# EAGLE design ToFnLED (EAGLE 9.6.2)
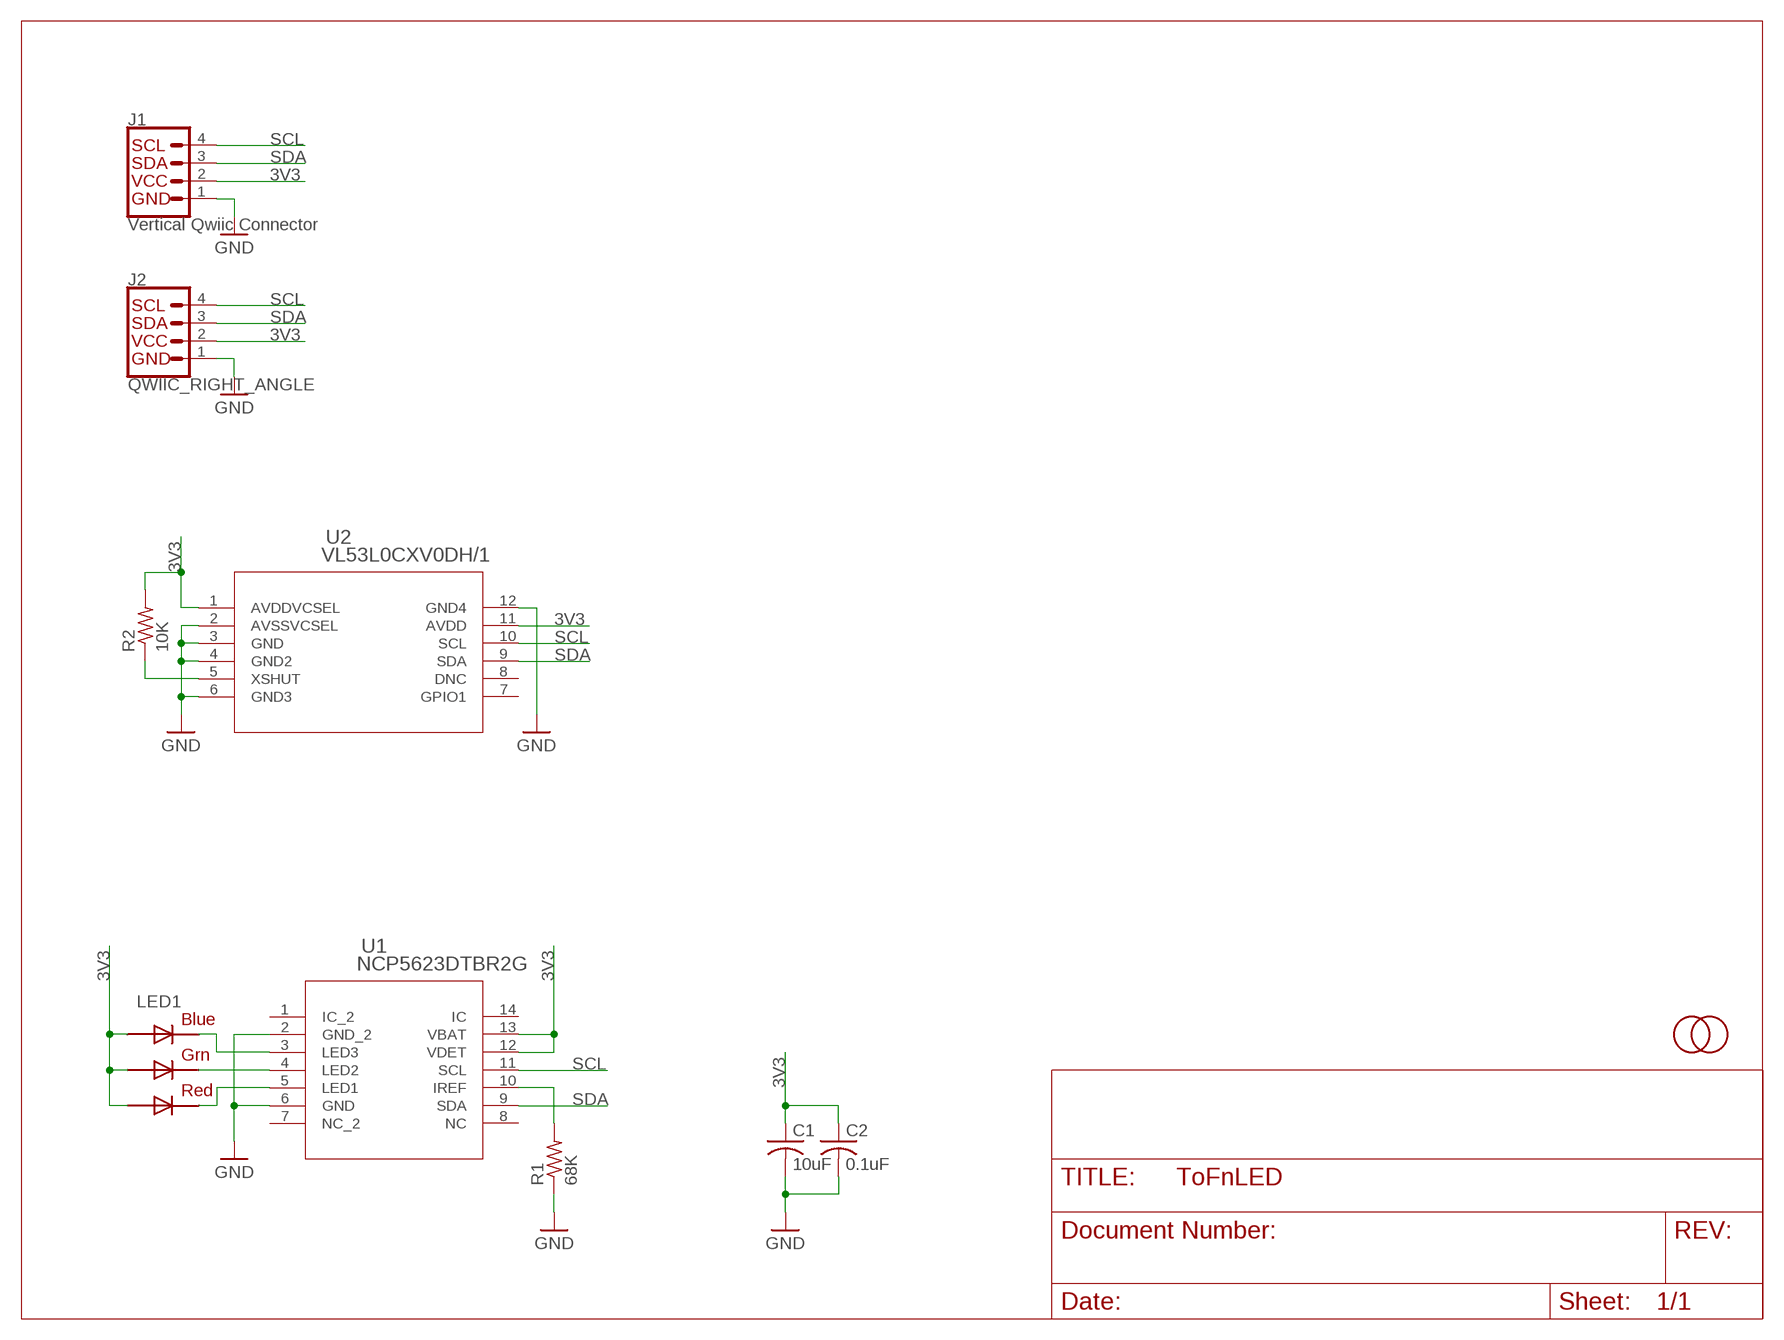
[diagram p0: schematic, sheet 1]

## Parts
C1  10uF  C-USC0603  [C0603]
C2  0.1uF  C-USC0603  [C0603]
J1  Vertical Qwiic Connector  QWIIC_CONNECTOR  [JST04_1MM_VERT]
J2  QWIIC_RIGHT_ANGLE  QWIIC_CONNECTORJS-1MM  [JST04_1MM_RA]
LED1  RGBLED5050  [RGBLED5050]
R1  68K  R-US_R0603  [R0603]
R2  10K  R-US_R0603  [R0603]
U1  NCP5623DTBR2G  [TSSOP-14_ONS]
U2  VL53L0CXV0DH/1  [LGA12_STM]
U$1  FIDUCIAL  [FIDUCIAL_1MM]
U$2  FIDUCIAL  [FIDUCIAL_1MM]

## Nets
3V3: C1.1 C2.1 J1.2 J2.2 LED1.1(GREEN_A) LED1.2(RED_A) LED1.3(BLUE_A) R2.2 U1.12(VDET) U1.13(VBAT) U2.1(AVDDVCSEL) U2.11(AVDD)
GND: C1.2 C2.2 J1.1 J2.1 R1.1 U1.2(GND_2) U1.6(GND) U2.2(AVSSVCSEL) U2.3(GND) U2.4(GND2) U2.6(GND3) U2.12(GND4)
LED1: LED1.5(RED_C) U1.5(LED1)
LED2: LED1.6(GREEN_C) U1.4(LED2)
LED3: LED1.4(BLUE_C) U1.3(LED3)
N$4: R1.2 U1.10(IREF)
N$6: R2.1 U2.5(XSHUT)
SCL: J1.4 J2.4 U1.11(SCL) U2.10(SCL)
SDA: J1.3 J2.3 U1.9(SDA) U2.9(SDA)
Unconnected: U1.1(IC_2) U1.7(NC_2) U1.8(NC) U1.14(IC) U2.7(GPIO1) U2.8(DNC)

## Library data of the parts
C1 = rcl:C-US: CAPACITOR, American symbol; LCSC: C19702; SPICEPREFIX: C
C2 = rcl:C-US: CAPACITOR, American symbol; LCSC: C1591; SPICEPREFIX: C
J1 = SparkFun-Connectors:QWIIC_CONNECTOR: SparkFun I2C Standard Qwiic Connector An SMD 1mm pitch JST connector makes it easy and quick (get it? Qwiic?) to connect I2C devices to each other. The Qwiic system <http://www.sparkfun.com/qwiic> enables fast and solderless connection between popular platforms and various sensors and actuators. We carry 200mm <https://www.sparkfun.com/products/14204>, 100mm <https://www.sparkfun.com/products/14205>, 50mm <https://www.sparkfun.com/products/14206>, and breadboard friendly <https://www.sparkfun.com/products/14207> Qwiic cables. We also offer 10 pcs strips <https://www.sparkfun.com/products/14323> the SMD connectors.; LCSC: C160390; PROD_ID: CONN-14483
J2 = SparkFun-Connectors:QWIIC_CONNECTOR: SparkFun I2C Standard Qwiic Connector An SMD 1mm pitch JST connector makes it easy and quick (get it? Qwiic?) to connect I2C devices to each other. The Qwiic system <http://www.sparkfun.com/qwiic> enables fast and solderless connection between popular platforms and various sensors and actuators. We carry 200mm <https://www.sparkfun.com/products/14204>, 100mm <https://www.sparkfun.com/products/14205>, 50mm <https://www.sparkfun.com/products/14206>, and breadboard friendly <https://www.sparkfun.com/products/14207> Qwiic cables. We also offer 10 pcs strips <https://www.sparkfun.com/products/14323> the SMD connectors.; LCSC: C160404; PROD_ID: CONN-13694
LED1 = adafruit:RGBLED: For 5050 RGB LEDs, the order of the LEDs may vary from one manufacturer to another!; LCSC: C784540
R1 = rcl:R-US_: RESISTOR, American symbol; LCSC: C114633; SPICEPREFIX: R
R2 = rcl:R-US_: RESISTOR, American symbol; LCSC: C98220; SPICEPREFIX: R
U1 = discrete:NCP5623DTBR2G; COPYRIGHT: Copyright (C) 2022 Ultra Librarian. All rights reserved.; LCSC: C904521; MANUFACTURER_PART_NUMBER: NCP5623DTBR2G; MFR_NAME: onsemi
U2 = discrete:VL53L0CXV0DH/1; COPYRIGHT: Copyright (C) 2022 Ultra Librarian. All rights reserved.; LCSC: C91199; MANUFACTURER_PART_NUMBER: VL53L0CXV0DH/1; MFR_NAME: STMicroelectronics
U$1 U$2 = adafruit:FIDUCIAL: For use by pick and place machines to calibrate the vision/machine, 1mm By microbuilder.eu

## Board
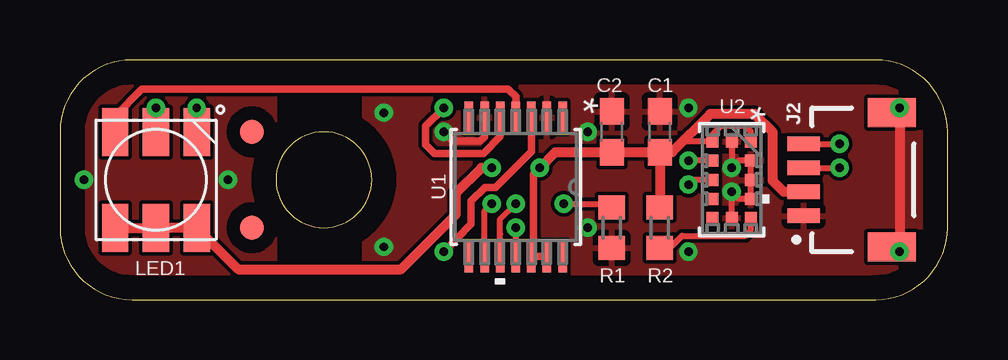
[diagram p1: board, top side]
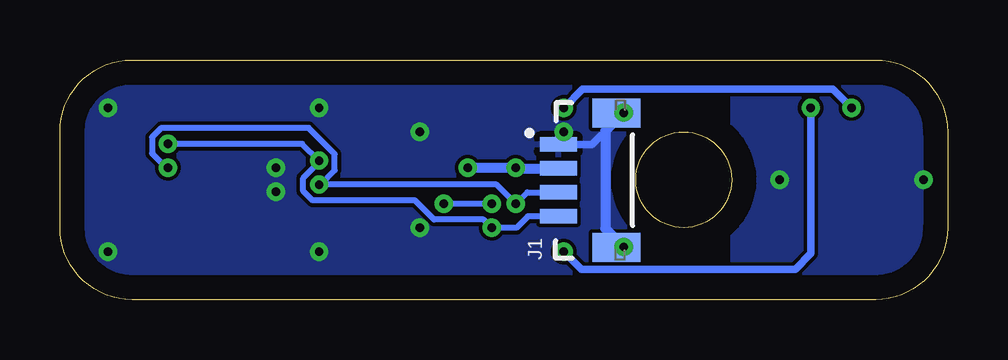
[diagram p2: board, bottom side, seen from below]

Size 37 x 10 mm. Coordinates in mm from the lower left corner, seen from the top.
Outline: 3,0 34,0 arc90 37,3 37,7 arc90 34,10 3,10 arc90 0,7 0,3 arc90 3,0
Outline: 9,5 arc180 13,5 arc180 9,5
Copper layers (1*16): Top 0.035mm / dielectric 1.5mm / Bottom 0.035mm
Design rules "default": minimum track width 6mil, minimum drill 0.35mm, track to track 6mil, track to pad 6mil, pad to pad 6mil, via to via 6mil, smd to smd 6mil, copper to edge 40mil, drill to drill 6mil, minimum pad ring 10mil, minimum via ring 8mil, stop-mask expansion 4mil, vias tented up to drill 0mil, thermal gap 10mil

### Footprints (pad centres in the part's own frame; a part is rotated, then mirrored left to right if it is on the bottom)
C0603 = smd 1.1 x 1: 1 -0.85,0; 2 0.85,0
JST04_1MM_VERT = smd 0.6 x 1.55: 1 -1.478,0.775; 2 -0.478,0.775; 3 0.522,0.775; 4 1.522,0.775 | smd 1.2 x 2: NC1 -2.778,3.2; NC2 2.822,3.2
JST04_1MM_RA = smd 0.6 x 1.35: 1 -1.5,0; 2 -0.5,0; 3 0.5,0; 4 1.5,0 | smd 1.2 x 2: NC1 2.8,-3.675; NC2 -2.8,-3.675
RGBLED5050 = smd 2 x 1.1: 1 -2,1.7; 2 -2,0; 3 -2,-1.7; 4 2,-1.7; 5 2,0; 6 2,1.7
R0603 = smd 1 x 1.1: 1 -0.85,0; 2 0.85,0
TSSOP-14_ONS = smd 1.308 x 0.356: 1 -2.902,1.95; 2 -2.902,1.3; 3 -2.902,0.65; 4 -2.902,0; 5 -2.902,-0.65; 6 -2.902,-1.3; 7 -2.902,-1.95; 8 2.902,-1.95; 9 2.902,-1.3; 10 2.902,-0.65; 11 2.902,0; 12 2.902,0.65; 13 2.902,1.3; 14 2.902,1.95
LGA12_STM = smd 0.5 x 0.5: 1 -1.6,0.8; 2 -0.8,0.8; 3 0,0.8; 4 0.8,0.8; 5 1.6,0.8; 6 1.6,0; 7 1.6,-0.8; 8 0.8,-0.8; 9 0,-0.8; 10 -0.8,-0.8; 11 -1.6,-0.8; 12 -1.6,0
FIDUCIAL_1MM = smd 1 x 1: 1 0,0

### Placement (x,y rotation side)
C1  25,7 90 top
C2  23,7 90 top
J1  17,5 270 bottom
J2  31,5 90 top
LED1  4,5 90 top
R1  23,3 90 top
R2  25,3 90 top
U1  19,4.7 270 top
U2  28,5 270 top
U$1  8,7 0 top
U$2  8,3 0 top

### Tracks (layer width: path | path; a pad name or v marks a point on that pad's centre or on a via)
3V3  (via drill 0.35)
  Top 0.254: U2.1 28.8,7.01 28.57,7.24 27.56,7.24 27.2,6.88 U2.11 25.96,6.6 25.51,6.15 C1.1
  Top 0.305: U1.13 U1.12 19.65,2.38 19.75,2.47 19.75,5.25 v20,5.5
  Top 0.406: LED1.1 LED1.2 LED1.3 7.43,1.27 14.22,1.27 16.51,3.56 16.51,4.45 17.57,5.5 v18,5.5 | v20,5.5 20.65,6.15 C2.1 C1.1 | C1.1 R2.2 | J2.2 30.17,4.5 29.72,4.95 29.72,6.99 28.96,7.75 27.11,7.75 25.51,6.15 C1.1
  Bottom 0.406: J1.2 17.98,5.48 v18,5.5 v20,5.5
GND  (via drill 0.35)
  Top 0.254: U2.12 v28,5.5 28.3,5.8 U2.2 U2.3 U2.4 28.3,4.2 v28,4.5 U2.6
  Top 0.305: U1.6 17.7,6.79 17.52,6.61 16.39,6.61 v16,7
  Top 0.406: v35,8 v35,2
  Bottom 0.305: v16,7 16.23,6.78 J1.1 14.82,6.48 v13.5,7.8
  Bottom 0.406: v13.5,2.2 14.26,2.96 14.26,7.04 v13.5,7.8
  other vias: 26.2,8 26.2,2 22,7 22,3
  pour Top: 12.7,0 36.83,0 36.83,10.16 12.7,10.16
  pour Bottom: 12.7,0 36.83,0 36.83,10.16 12.7,10.16
LED1  (via drill 0.35)
  Top 0.254: LED1.5 v4,8
  Top 0.305: v16,8 15.24,7.24 15.24,6.48 15.62,6.1 17.65,6.1 18.35,6.79 U1.5
  Bottom 0.305: v16,8 15.21,8.79 4.79,8.79 v4,8
LED2
  Top 0.305: LED1.6 2.3,7.67 3.42,8.78 18.68,8.78 19,8.46 U1.4
LED3  (via drill 0.35, 0.35 pad 0.65)
  Top 0.254: LED1.4 v5.7,8
  Top 0.305: v16,2 16.57,2.57 16.57,2.58 17.14,3.15 17.14,4.11 17.72,4.68 18.15,4.68 19.65,6.18 U1.3
  Bottom 0.305: v5.7,8 5.7,1.92 6.35,1.27 15.27,1.27 v16,2
N$4  (via drill 0.35)
  Top 0.254: U1.10 18.35,2.72 18.34,2.73 18.34,3.34 v19,4 | v21,4 22.85,4 R1.2
  Bottom 0.254: v19,4 v21,4
N$5  (via drill 0.35)
  other vias: 7,5 1,5
  pour Bottom: 0,0 9,0 9,10 0,10
  pour Top: 0,0 9,0 9,10 0,10
N$6
  Top 0.254: R2.1 25.42,2.15 25.93,2.66 28.57,2.66 28.8,2.89 U2.5
SCL  (via drill 0.35)
  Top 0.254: J2.4 v32.5,6.5 | U1.11 v19,3 | U2.10 v26.2,5.8
  Bottom 0.254: v32.5,6.5 26.9,6.5 v26.2,5.8 26.2,5.73 26.86,5.07 26.86,4.53 26.47,4.14 22.2,4.14 21.4,3.34 19.34,3.34 v19,3 17.97,3 17.5,3.48 J1.4
SDA  (via drill 0.35)
  Top 0.254: J2.3 v32.5,5.5 | U1.9 17.7,3.7 v18,4 | U2.9 26.4,5 v26.2,4.8
  Bottom 0.254: v32.5,5.5 32.56,5.5 33.16,6.1 33.16,6.77 32.77,7.16 26.63,7.16 25.54,6.07 25.54,5.4 26.14,4.8 v26.2,4.8 18.8,4.8 v18,4 17.52,4.48 J1.3